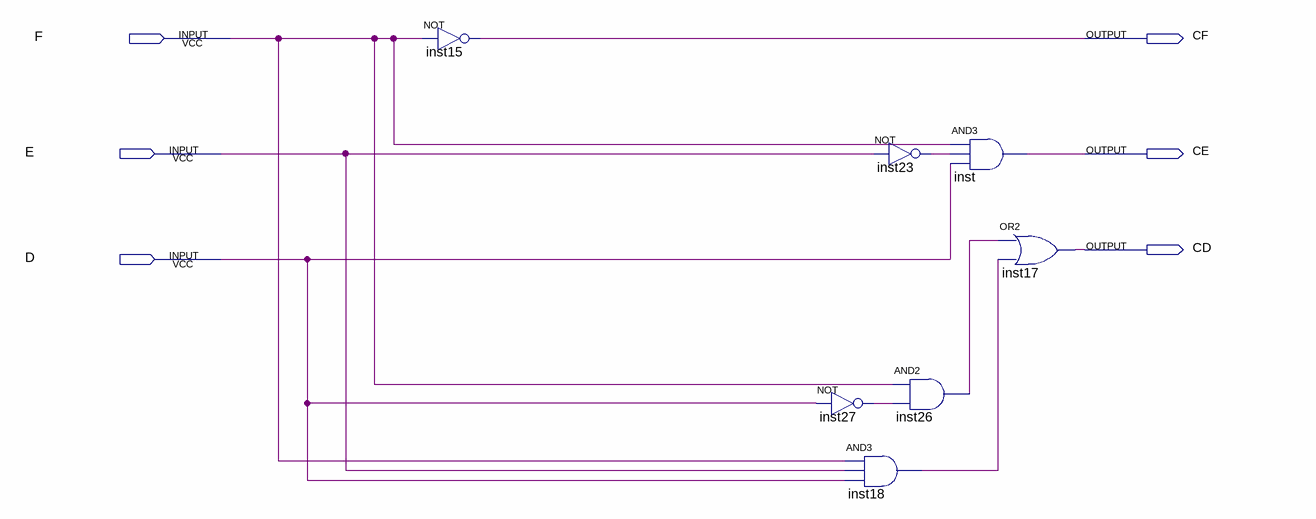
[diagram p0: schematic sheet]
// Quartus schematic aula03.bdf as structural Verilog: 7 symbols, 6 pins
module aula03 (
  input  F,
  input  E,
  input  D,
  output CF,
  output CE,
  output CD
);

  wire inst18_out, inst23_out, inst26_out, inst27_out;

  not inst15 (CF, F);
  not inst27 (inst27_out, D);
  and inst18 (inst18_out, F, E, D);
  not inst23 (inst23_out, E);
  and inst26 (inst26_out, F, inst27_out);
  and inst (CE, F, inst23_out, D);
  or inst17 (CD, inst26_out, inst18_out);
endmodule
